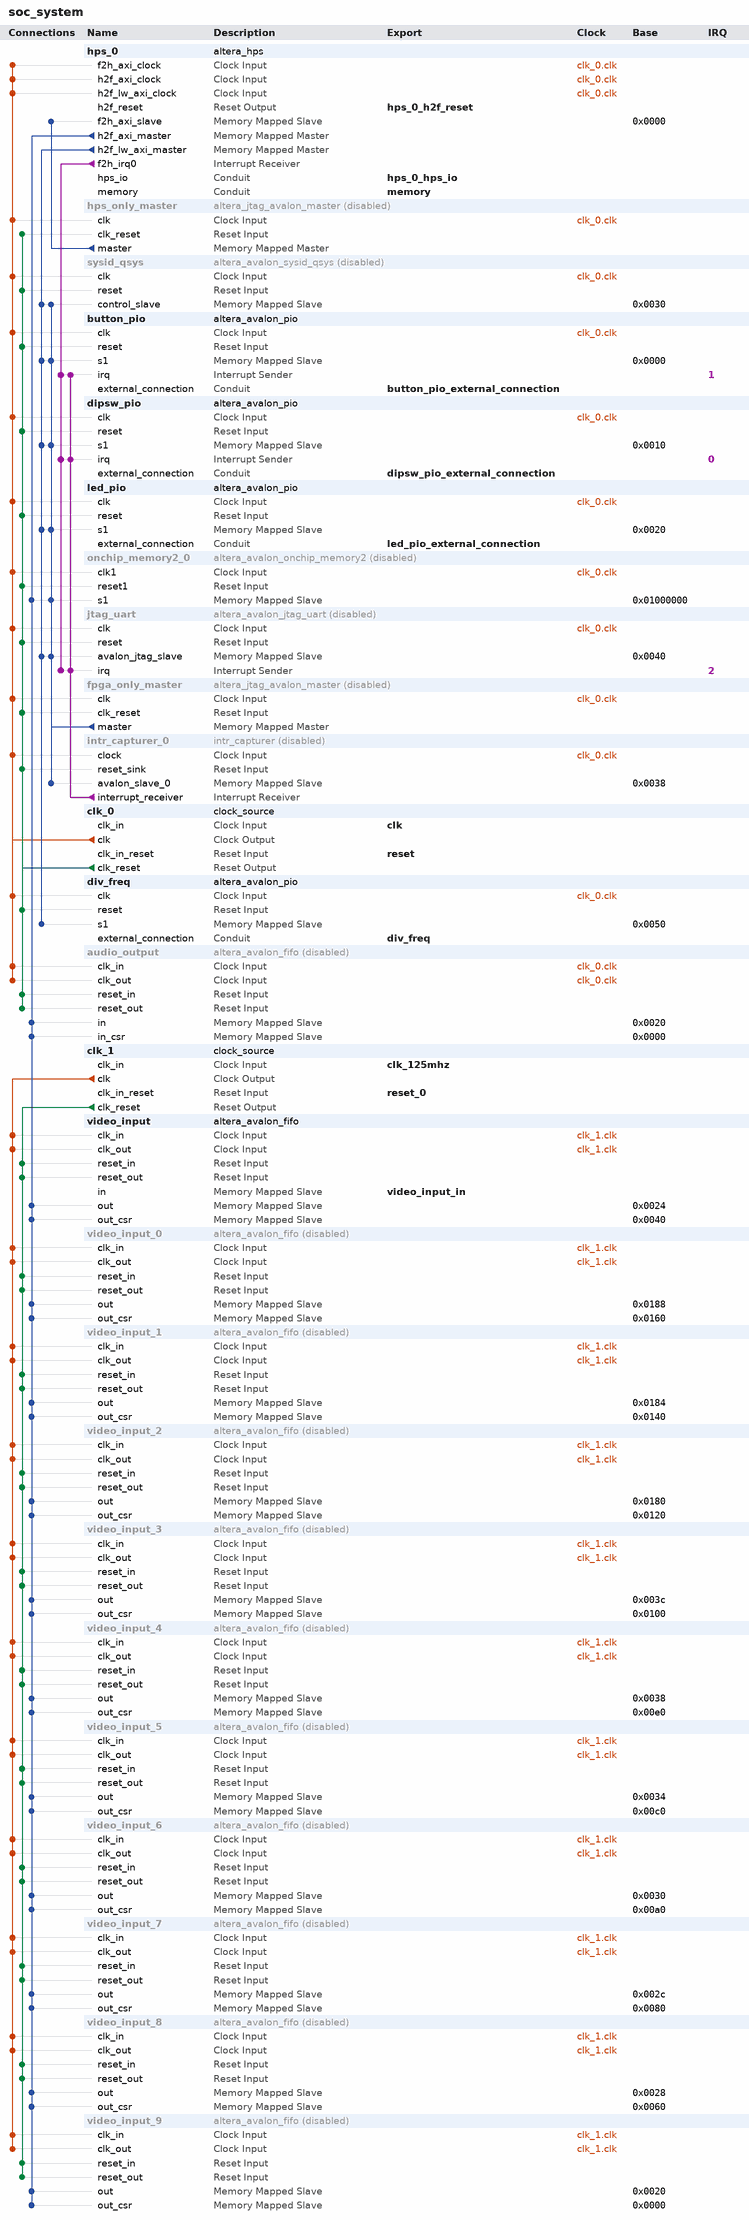
[diagram p0: system contents]
# Platform Designer (Qsys) system soc_system, Cyclone V 5CSEMA4U23C6
# Parameters at their usual value, and those the tool derives, are not listed.
package require -exact qsys 15.0
create_system soc_system
set_project_property DEVICE_FAMILY {Cyclone V}
set_project_property DEVICE 5CSEMA4U23C6

add_instance hps_0 altera_hps 15.0
set_instance_parameter_value hps_0 EMAC1_Mode RGMII
set_instance_parameter_value hps_0 EMAC1_PinMuxing {HPS I/O Set 0}
set_instance_parameter_value hps_0 F2SCLK_COLDRST_Enable false
set_instance_parameter_value hps_0 F2SCLK_DBGRST_Enable false
set_instance_parameter_value hps_0 F2SCLK_WARMRST_Enable false
set_instance_parameter_value hps_0 F2SINTERRUPT_Enable true
set_instance_parameter_value hps_0 F2S_Width 3
set_instance_parameter_value hps_0 FPGA_PERIPHERAL_OUTPUT_CLOCK_FREQ_EMAC0_GTX_CLK 100
set_instance_parameter_value hps_0 FPGA_PERIPHERAL_OUTPUT_CLOCK_FREQ_EMAC0_MD_CLK 100.0
set_instance_parameter_value hps_0 FPGA_PERIPHERAL_OUTPUT_CLOCK_FREQ_EMAC1_GTX_CLK 100
set_instance_parameter_value hps_0 FPGA_PERIPHERAL_OUTPUT_CLOCK_FREQ_EMAC1_MD_CLK 100.0
set_instance_parameter_value hps_0 HPS_PROTOCOL DDR3
set_instance_parameter_value hps_0 I2C0_Mode I2C
set_instance_parameter_value hps_0 I2C0_PinMuxing {HPS I/O Set 0}
set_instance_parameter_value hps_0 I2C1_Mode I2C
set_instance_parameter_value hps_0 I2C1_PinMuxing {HPS I/O Set 0}
set_instance_parameter_value hps_0 LWH2F_Enable true
set_instance_parameter_value hps_0 MEM_BANKADDR_WIDTH 3
set_instance_parameter_value hps_0 MEM_CLK_FREQ 400.0
set_instance_parameter_value hps_0 MEM_COL_ADDR_WIDTH 10
set_instance_parameter_value hps_0 MEM_DQ_WIDTH 32
set_instance_parameter_value hps_0 MEM_DRV_STR RZQ/6
set_instance_parameter_value hps_0 MEM_ROW_ADDR_WIDTH 15
set_instance_parameter_value hps_0 MEM_RTT_NOM RZQ/6
set_instance_parameter_value hps_0 MEM_RTT_WR {Dynamic ODT off}
set_instance_parameter_value hps_0 MEM_TCL 7
set_instance_parameter_value hps_0 MEM_TFAW_NS 37.5
set_instance_parameter_value hps_0 MEM_TRAS_NS 35.0
set_instance_parameter_value hps_0 MEM_TRCD_NS 13.75
set_instance_parameter_value hps_0 MEM_TRFC_NS 300.0
set_instance_parameter_value hps_0 MEM_TRP_NS 13.75
set_instance_parameter_value hps_0 MEM_VENDOR Other
set_instance_parameter_value hps_0 MEM_WTCL 7
set_instance_parameter_value hps_0 QSPI_Mode N/A
set_instance_parameter_value hps_0 QSPI_PinMuxing Unused
set_instance_parameter_value hps_0 REF_CLK_FREQ 25.0
set_instance_parameter_value hps_0 S2F_Width 2
set_instance_parameter_value hps_0 SDIO_Mode {4-bit Data}
set_instance_parameter_value hps_0 SDIO_PinMuxing {HPS I/O Set 0}
set_instance_parameter_value hps_0 SPIM1_Mode {Single Slave Select}
set_instance_parameter_value hps_0 SPIM1_PinMuxing {HPS I/O Set 0}
set_instance_parameter_value hps_0 STM_Enable false
set_instance_parameter_value hps_0 TIMING_BOARD_AC_SKEW 0.02
set_instance_parameter_value hps_0 TIMING_BOARD_AC_TO_CK_SKEW 0.0
set_instance_parameter_value hps_0 TIMING_BOARD_DQ_TO_DQS_SKEW 0.0
set_instance_parameter_value hps_0 TIMING_BOARD_MAX_CK_DELAY 0.6
set_instance_parameter_value hps_0 TIMING_BOARD_MAX_DQS_DELAY 0.6
set_instance_parameter_value hps_0 TIMING_BOARD_SKEW_BETWEEN_DQS 0.02
set_instance_parameter_value hps_0 TIMING_BOARD_SKEW_CKDQS_DIMM_MAX 0.01
set_instance_parameter_value hps_0 TIMING_BOARD_SKEW_CKDQS_DIMM_MIN -0.01
set_instance_parameter_value hps_0 TIMING_BOARD_SKEW_WITHIN_DQS 0.02
set_instance_parameter_value hps_0 TIMING_TDH 125
set_instance_parameter_value hps_0 TIMING_TDQSCK 400
set_instance_parameter_value hps_0 TIMING_TDQSQ 120
set_instance_parameter_value hps_0 TIMING_TDS 50
set_instance_parameter_value hps_0 TIMING_TIH 250
set_instance_parameter_value hps_0 TIMING_TIS 175
set_instance_parameter_value hps_0 TIMING_TQSH 0.38
set_instance_parameter_value hps_0 UART0_Mode {No Flow Control}
set_instance_parameter_value hps_0 UART0_PinMuxing {HPS I/O Set 0}
set_instance_parameter_value hps_0 USB1_Mode SDR
set_instance_parameter_value hps_0 USB1_PinMuxing {HPS I/O Set 0}
set_instance_parameter_value hps_0 desired_cfg_clk_mhz 100.0
set_instance_parameter_value hps_0 desired_qspi_clk_mhz 370.0

add_instance hps_only_master altera_jtag_avalon_master 15.0
set_instance_property hps_only_master ENABLED false

add_instance sysid_qsys altera_avalon_sysid_qsys 15.0
set_instance_property sysid_qsys ENABLED false
set_instance_parameter_value sysid_qsys id -1395322110

add_instance button_pio altera_avalon_pio 15.0
set_instance_parameter_value button_pio bitClearingEdgeCapReg true
set_instance_parameter_value button_pio captureEdge true
set_instance_parameter_value button_pio direction Input
set_instance_parameter_value button_pio edgeType FALLING
set_instance_parameter_value button_pio generateIRQ true
set_instance_parameter_value button_pio irqType EDGE
set_instance_parameter_value button_pio width 4

add_instance dipsw_pio altera_avalon_pio 15.0
set_instance_parameter_value dipsw_pio bitClearingEdgeCapReg true
set_instance_parameter_value dipsw_pio captureEdge true
set_instance_parameter_value dipsw_pio direction Input
set_instance_parameter_value dipsw_pio edgeType ANY
set_instance_parameter_value dipsw_pio generateIRQ true
set_instance_parameter_value dipsw_pio irqType EDGE
set_instance_parameter_value dipsw_pio width 4

add_instance led_pio altera_avalon_pio 15.0
set_instance_parameter_value led_pio direction Output
set_instance_parameter_value led_pio width 8

add_instance onchip_memory2_0 altera_avalon_onchip_memory2 15.0
set_instance_property onchip_memory2_0 ENABLED false
set_instance_parameter_value onchip_memory2_0 dataWidth 64
set_instance_parameter_value onchip_memory2_0 dualPort false
set_instance_parameter_value onchip_memory2_0 initMemContent true
set_instance_parameter_value onchip_memory2_0 initializationFileName onchip_memory2_0
set_instance_parameter_value onchip_memory2_0 memorySize 65536

add_instance jtag_uart altera_avalon_jtag_uart 15.0
set_instance_property jtag_uart ENABLED false
set_instance_parameter_value jtag_uart allowMultipleConnections true
set_instance_parameter_value jtag_uart simInteractiveOptions INTERACTIVE_ASCII_OUTPUT

add_instance fpga_only_master altera_jtag_avalon_master 15.0
set_instance_property fpga_only_master ENABLED false

add_instance intr_capturer_0 intr_capturer 100.99.98.97
set_instance_property intr_capturer_0 ENABLED false

add_instance clk_0 clock_source 15.0
set_instance_parameter_value clk_0 clockFrequency 50000000

add_instance div_freq altera_avalon_pio 15.0
set_instance_parameter_value div_freq direction Output
set_instance_parameter_value div_freq width 32

add_instance audio_output altera_avalon_fifo 15.0
set_instance_property audio_output ENABLED false
set_instance_parameter_value audio_output bitsPerSymbol 16
set_instance_parameter_value audio_output channelWidth 8
set_instance_parameter_value audio_output errorWidth 8
set_instance_parameter_value audio_output fifoDepth 256
set_instance_parameter_value audio_output fifoInputInterfaceOptions AVALONMM_WRITE
set_instance_parameter_value audio_output fifoOutputInterfaceOptions AVALONMM_READ
set_instance_parameter_value audio_output singleClockMode false
set_instance_parameter_value audio_output symbolsPerBeat 2
set_instance_parameter_value audio_output useIRQ false
set_instance_parameter_value audio_output usePacket true
set_instance_parameter_value audio_output useReadControl false

add_instance clk_1 clock_source 15.0
set_instance_parameter_value clk_1 clockFrequency 125000000

add_instance video_input altera_avalon_fifo 15.0
set_instance_parameter_value video_input bitsPerSymbol 16
set_instance_parameter_value video_input channelWidth 8
set_instance_parameter_value video_input errorWidth 8
set_instance_parameter_value video_input fifoDepth 1024
set_instance_parameter_value video_input fifoInputInterfaceOptions AVALONMM_WRITE
set_instance_parameter_value video_input fifoOutputInterfaceOptions AVALONMM_READ
set_instance_parameter_value video_input singleClockMode false
set_instance_parameter_value video_input symbolsPerBeat 2
set_instance_parameter_value video_input useIRQ false
set_instance_parameter_value video_input usePacket true
set_instance_parameter_value video_input useReadControl true
set_instance_parameter_value video_input useWriteControl false

add_instance video_input_0 altera_avalon_fifo 15.0
set_instance_property video_input_0 ENABLED false
set_instance_parameter_value video_input_0 bitsPerSymbol 16
set_instance_parameter_value video_input_0 channelWidth 8
set_instance_parameter_value video_input_0 errorWidth 8
set_instance_parameter_value video_input_0 fifoDepth 1024
set_instance_parameter_value video_input_0 fifoInputInterfaceOptions AVALONMM_WRITE
set_instance_parameter_value video_input_0 fifoOutputInterfaceOptions AVALONMM_READ
set_instance_parameter_value video_input_0 singleClockMode false
set_instance_parameter_value video_input_0 symbolsPerBeat 2
set_instance_parameter_value video_input_0 useIRQ false
set_instance_parameter_value video_input_0 usePacket true
set_instance_parameter_value video_input_0 useReadControl true
set_instance_parameter_value video_input_0 useWriteControl false

add_instance video_input_1 altera_avalon_fifo 15.0
set_instance_property video_input_1 ENABLED false
set_instance_parameter_value video_input_1 bitsPerSymbol 16
set_instance_parameter_value video_input_1 channelWidth 8
set_instance_parameter_value video_input_1 errorWidth 8
set_instance_parameter_value video_input_1 fifoDepth 1024
set_instance_parameter_value video_input_1 fifoInputInterfaceOptions AVALONMM_WRITE
set_instance_parameter_value video_input_1 fifoOutputInterfaceOptions AVALONMM_READ
set_instance_parameter_value video_input_1 singleClockMode false
set_instance_parameter_value video_input_1 symbolsPerBeat 2
set_instance_parameter_value video_input_1 useIRQ false
set_instance_parameter_value video_input_1 usePacket true
set_instance_parameter_value video_input_1 useReadControl true
set_instance_parameter_value video_input_1 useWriteControl false

add_instance video_input_2 altera_avalon_fifo 15.0
set_instance_property video_input_2 ENABLED false
set_instance_parameter_value video_input_2 bitsPerSymbol 16
set_instance_parameter_value video_input_2 channelWidth 8
set_instance_parameter_value video_input_2 errorWidth 8
set_instance_parameter_value video_input_2 fifoDepth 1024
set_instance_parameter_value video_input_2 fifoInputInterfaceOptions AVALONMM_WRITE
set_instance_parameter_value video_input_2 fifoOutputInterfaceOptions AVALONMM_READ
set_instance_parameter_value video_input_2 singleClockMode false
set_instance_parameter_value video_input_2 symbolsPerBeat 2
set_instance_parameter_value video_input_2 useIRQ false
set_instance_parameter_value video_input_2 usePacket true
set_instance_parameter_value video_input_2 useReadControl true
set_instance_parameter_value video_input_2 useWriteControl false

add_instance video_input_3 altera_avalon_fifo 15.0
set_instance_property video_input_3 ENABLED false
set_instance_parameter_value video_input_3 bitsPerSymbol 16
set_instance_parameter_value video_input_3 channelWidth 8
set_instance_parameter_value video_input_3 errorWidth 8
set_instance_parameter_value video_input_3 fifoDepth 1024
set_instance_parameter_value video_input_3 fifoInputInterfaceOptions AVALONMM_WRITE
set_instance_parameter_value video_input_3 fifoOutputInterfaceOptions AVALONMM_READ
set_instance_parameter_value video_input_3 singleClockMode false
set_instance_parameter_value video_input_3 symbolsPerBeat 2
set_instance_parameter_value video_input_3 useIRQ false
set_instance_parameter_value video_input_3 usePacket true
set_instance_parameter_value video_input_3 useReadControl true
set_instance_parameter_value video_input_3 useWriteControl false

add_instance video_input_4 altera_avalon_fifo 15.0
set_instance_property video_input_4 ENABLED false
set_instance_parameter_value video_input_4 bitsPerSymbol 16
set_instance_parameter_value video_input_4 channelWidth 8
set_instance_parameter_value video_input_4 errorWidth 8
set_instance_parameter_value video_input_4 fifoDepth 1024
set_instance_parameter_value video_input_4 fifoInputInterfaceOptions AVALONMM_WRITE
set_instance_parameter_value video_input_4 fifoOutputInterfaceOptions AVALONMM_READ
set_instance_parameter_value video_input_4 singleClockMode false
set_instance_parameter_value video_input_4 symbolsPerBeat 2
set_instance_parameter_value video_input_4 useIRQ false
set_instance_parameter_value video_input_4 usePacket true
set_instance_parameter_value video_input_4 useReadControl true
set_instance_parameter_value video_input_4 useWriteControl false

add_instance video_input_5 altera_avalon_fifo 15.0
set_instance_property video_input_5 ENABLED false
set_instance_parameter_value video_input_5 bitsPerSymbol 16
set_instance_parameter_value video_input_5 channelWidth 8
set_instance_parameter_value video_input_5 errorWidth 8
set_instance_parameter_value video_input_5 fifoDepth 1024
set_instance_parameter_value video_input_5 fifoInputInterfaceOptions AVALONMM_WRITE
set_instance_parameter_value video_input_5 fifoOutputInterfaceOptions AVALONMM_READ
set_instance_parameter_value video_input_5 singleClockMode false
set_instance_parameter_value video_input_5 symbolsPerBeat 2
set_instance_parameter_value video_input_5 useIRQ false
set_instance_parameter_value video_input_5 usePacket true
set_instance_parameter_value video_input_5 useReadControl true
set_instance_parameter_value video_input_5 useWriteControl false

add_instance video_input_6 altera_avalon_fifo 15.0
set_instance_property video_input_6 ENABLED false
set_instance_parameter_value video_input_6 bitsPerSymbol 16
set_instance_parameter_value video_input_6 channelWidth 8
set_instance_parameter_value video_input_6 errorWidth 8
set_instance_parameter_value video_input_6 fifoDepth 1024
set_instance_parameter_value video_input_6 fifoInputInterfaceOptions AVALONMM_WRITE
set_instance_parameter_value video_input_6 fifoOutputInterfaceOptions AVALONMM_READ
set_instance_parameter_value video_input_6 singleClockMode false
set_instance_parameter_value video_input_6 symbolsPerBeat 2
set_instance_parameter_value video_input_6 useIRQ false
set_instance_parameter_value video_input_6 usePacket true
set_instance_parameter_value video_input_6 useReadControl true
set_instance_parameter_value video_input_6 useWriteControl false

add_instance video_input_7 altera_avalon_fifo 15.0
set_instance_property video_input_7 ENABLED false
set_instance_parameter_value video_input_7 bitsPerSymbol 16
set_instance_parameter_value video_input_7 channelWidth 8
set_instance_parameter_value video_input_7 errorWidth 8
set_instance_parameter_value video_input_7 fifoDepth 1024
set_instance_parameter_value video_input_7 fifoInputInterfaceOptions AVALONMM_WRITE
set_instance_parameter_value video_input_7 fifoOutputInterfaceOptions AVALONMM_READ
set_instance_parameter_value video_input_7 singleClockMode false
set_instance_parameter_value video_input_7 symbolsPerBeat 2
set_instance_parameter_value video_input_7 useIRQ false
set_instance_parameter_value video_input_7 usePacket true
set_instance_parameter_value video_input_7 useReadControl true
set_instance_parameter_value video_input_7 useWriteControl false

add_instance video_input_8 altera_avalon_fifo 15.0
set_instance_property video_input_8 ENABLED false
set_instance_parameter_value video_input_8 bitsPerSymbol 16
set_instance_parameter_value video_input_8 channelWidth 8
set_instance_parameter_value video_input_8 errorWidth 8
set_instance_parameter_value video_input_8 fifoDepth 1024
set_instance_parameter_value video_input_8 fifoInputInterfaceOptions AVALONMM_WRITE
set_instance_parameter_value video_input_8 fifoOutputInterfaceOptions AVALONMM_READ
set_instance_parameter_value video_input_8 singleClockMode false
set_instance_parameter_value video_input_8 symbolsPerBeat 2
set_instance_parameter_value video_input_8 useIRQ false
set_instance_parameter_value video_input_8 usePacket true
set_instance_parameter_value video_input_8 useReadControl true
set_instance_parameter_value video_input_8 useWriteControl false

add_instance video_input_9 altera_avalon_fifo 15.0
set_instance_property video_input_9 ENABLED false
set_instance_parameter_value video_input_9 bitsPerSymbol 16
set_instance_parameter_value video_input_9 channelWidth 8
set_instance_parameter_value video_input_9 errorWidth 8
set_instance_parameter_value video_input_9 fifoDepth 1024
set_instance_parameter_value video_input_9 fifoInputInterfaceOptions AVALONMM_WRITE
set_instance_parameter_value video_input_9 fifoOutputInterfaceOptions AVALONMM_READ
set_instance_parameter_value video_input_9 singleClockMode false
set_instance_parameter_value video_input_9 symbolsPerBeat 2
set_instance_parameter_value video_input_9 useIRQ false
set_instance_parameter_value video_input_9 usePacket true
set_instance_parameter_value video_input_9 useReadControl true
set_instance_parameter_value video_input_9 useWriteControl false

# connections
add_connection clk_0.clk audio_output.clk_in clock
add_connection clk_0.clk audio_output.clk_out clock
add_connection clk_0.clk button_pio.clk clock
add_connection clk_0.clk dipsw_pio.clk clock
add_connection clk_0.clk div_freq.clk clock
add_connection clk_0.clk fpga_only_master.clk clock
add_connection clk_0.clk hps_0.f2h_axi_clock clock
add_connection clk_0.clk hps_0.h2f_axi_clock clock
add_connection clk_0.clk hps_0.h2f_lw_axi_clock clock
add_connection clk_0.clk hps_only_master.clk clock
add_connection clk_0.clk intr_capturer_0.clock clock
add_connection clk_0.clk jtag_uart.clk clock
add_connection clk_0.clk led_pio.clk clock
add_connection clk_0.clk onchip_memory2_0.clk1 clock
add_connection clk_0.clk sysid_qsys.clk clock
add_connection clk_1.clk video_input.clk_in clock
add_connection clk_1.clk video_input.clk_out clock
add_connection clk_1.clk video_input_0.clk_in clock
add_connection clk_1.clk video_input_0.clk_out clock
add_connection clk_1.clk video_input_1.clk_in clock
add_connection clk_1.clk video_input_1.clk_out clock
add_connection clk_1.clk video_input_2.clk_in clock
add_connection clk_1.clk video_input_2.clk_out clock
add_connection clk_1.clk video_input_3.clk_in clock
add_connection clk_1.clk video_input_3.clk_out clock
add_connection clk_1.clk video_input_4.clk_in clock
add_connection clk_1.clk video_input_4.clk_out clock
add_connection clk_1.clk video_input_5.clk_in clock
add_connection clk_1.clk video_input_5.clk_out clock
add_connection clk_1.clk video_input_6.clk_in clock
add_connection clk_1.clk video_input_6.clk_out clock
add_connection clk_1.clk video_input_7.clk_in clock
add_connection clk_1.clk video_input_7.clk_out clock
add_connection clk_1.clk video_input_8.clk_in clock
add_connection clk_1.clk video_input_8.clk_out clock
add_connection clk_1.clk video_input_9.clk_in clock
add_connection clk_1.clk video_input_9.clk_out clock
add_connection clk_0.clk_reset audio_output.reset_in reset
add_connection clk_0.clk_reset audio_output.reset_out reset
add_connection clk_0.clk_reset button_pio.reset reset
add_connection clk_0.clk_reset dipsw_pio.reset reset
add_connection clk_0.clk_reset div_freq.reset reset
add_connection clk_0.clk_reset fpga_only_master.clk_reset reset
add_connection clk_0.clk_reset hps_only_master.clk_reset reset
add_connection clk_0.clk_reset intr_capturer_0.reset_sink reset
add_connection clk_0.clk_reset jtag_uart.reset reset
add_connection clk_0.clk_reset led_pio.reset reset
add_connection clk_0.clk_reset onchip_memory2_0.reset1 reset
add_connection clk_0.clk_reset sysid_qsys.reset reset
add_connection clk_1.clk_reset video_input.reset_in reset
add_connection clk_1.clk_reset video_input.reset_out reset
add_connection clk_1.clk_reset video_input_0.reset_in reset
add_connection clk_1.clk_reset video_input_0.reset_out reset
add_connection clk_1.clk_reset video_input_1.reset_in reset
add_connection clk_1.clk_reset video_input_1.reset_out reset
add_connection clk_1.clk_reset video_input_2.reset_in reset
add_connection clk_1.clk_reset video_input_2.reset_out reset
add_connection clk_1.clk_reset video_input_3.reset_in reset
add_connection clk_1.clk_reset video_input_3.reset_out reset
add_connection clk_1.clk_reset video_input_4.reset_in reset
add_connection clk_1.clk_reset video_input_4.reset_out reset
add_connection clk_1.clk_reset video_input_5.reset_in reset
add_connection clk_1.clk_reset video_input_5.reset_out reset
add_connection clk_1.clk_reset video_input_6.reset_in reset
add_connection clk_1.clk_reset video_input_6.reset_out reset
add_connection clk_1.clk_reset video_input_7.reset_in reset
add_connection clk_1.clk_reset video_input_7.reset_out reset
add_connection clk_1.clk_reset video_input_8.reset_in reset
add_connection clk_1.clk_reset video_input_8.reset_out reset
add_connection clk_1.clk_reset video_input_9.reset_in reset
add_connection clk_1.clk_reset video_input_9.reset_out reset
add_connection fpga_only_master.master button_pio.s1 avalon
set_connection_parameter_value fpga_only_master.master/button_pio.s1 baseAddress 0x0000
add_connection fpga_only_master.master dipsw_pio.s1 avalon
set_connection_parameter_value fpga_only_master.master/dipsw_pio.s1 baseAddress 0x0010
add_connection fpga_only_master.master intr_capturer_0.avalon_slave_0 avalon
set_connection_parameter_value fpga_only_master.master/intr_capturer_0.avalon_slave_0 baseAddress 0x0038
add_connection fpga_only_master.master jtag_uart.avalon_jtag_slave avalon
set_connection_parameter_value fpga_only_master.master/jtag_uart.avalon_jtag_slave baseAddress 0x0040
add_connection fpga_only_master.master led_pio.s1 avalon
set_connection_parameter_value fpga_only_master.master/led_pio.s1 baseAddress 0x0020
add_connection fpga_only_master.master onchip_memory2_0.s1 avalon
set_connection_parameter_value fpga_only_master.master/onchip_memory2_0.s1 baseAddress 0x01000000
add_connection fpga_only_master.master sysid_qsys.control_slave avalon
set_connection_parameter_value fpga_only_master.master/sysid_qsys.control_slave baseAddress 0x0030
add_connection hps_0.h2f_axi_master audio_output.in avalon
set_connection_parameter_value hps_0.h2f_axi_master/audio_output.in baseAddress 0x0020
add_connection hps_0.h2f_axi_master audio_output.in_csr avalon
set_connection_parameter_value hps_0.h2f_axi_master/audio_output.in_csr baseAddress 0x0000
add_connection hps_0.h2f_axi_master onchip_memory2_0.s1 avalon
set_connection_parameter_value hps_0.h2f_axi_master/onchip_memory2_0.s1 baseAddress 0x01000000
add_connection hps_0.h2f_axi_master video_input.out avalon
set_connection_parameter_value hps_0.h2f_axi_master/video_input.out baseAddress 0x0024
add_connection hps_0.h2f_axi_master video_input.out_csr avalon
set_connection_parameter_value hps_0.h2f_axi_master/video_input.out_csr baseAddress 0x0040
add_connection hps_0.h2f_axi_master video_input_0.out avalon
set_connection_parameter_value hps_0.h2f_axi_master/video_input_0.out baseAddress 0x0188
add_connection hps_0.h2f_axi_master video_input_0.out_csr avalon
set_connection_parameter_value hps_0.h2f_axi_master/video_input_0.out_csr baseAddress 0x0160
add_connection hps_0.h2f_axi_master video_input_1.out avalon
set_connection_parameter_value hps_0.h2f_axi_master/video_input_1.out baseAddress 0x0184
add_connection hps_0.h2f_axi_master video_input_1.out_csr avalon
set_connection_parameter_value hps_0.h2f_axi_master/video_input_1.out_csr baseAddress 0x0140
add_connection hps_0.h2f_axi_master video_input_2.out avalon
set_connection_parameter_value hps_0.h2f_axi_master/video_input_2.out baseAddress 0x0180
add_connection hps_0.h2f_axi_master video_input_2.out_csr avalon
set_connection_parameter_value hps_0.h2f_axi_master/video_input_2.out_csr baseAddress 0x0120
add_connection hps_0.h2f_axi_master video_input_3.out avalon
set_connection_parameter_value hps_0.h2f_axi_master/video_input_3.out baseAddress 0x003c
add_connection hps_0.h2f_axi_master video_input_3.out_csr avalon
set_connection_parameter_value hps_0.h2f_axi_master/video_input_3.out_csr baseAddress 0x0100
add_connection hps_0.h2f_axi_master video_input_4.out avalon
set_connection_parameter_value hps_0.h2f_axi_master/video_input_4.out baseAddress 0x0038
add_connection hps_0.h2f_axi_master video_input_4.out_csr avalon
set_connection_parameter_value hps_0.h2f_axi_master/video_input_4.out_csr baseAddress 0x00e0
add_connection hps_0.h2f_axi_master video_input_5.out avalon
set_connection_parameter_value hps_0.h2f_axi_master/video_input_5.out baseAddress 0x0034
add_connection hps_0.h2f_axi_master video_input_5.out_csr avalon
set_connection_parameter_value hps_0.h2f_axi_master/video_input_5.out_csr baseAddress 0x00c0
add_connection hps_0.h2f_axi_master video_input_6.out avalon
set_connection_parameter_value hps_0.h2f_axi_master/video_input_6.out baseAddress 0x0030
add_connection hps_0.h2f_axi_master video_input_6.out_csr avalon
set_connection_parameter_value hps_0.h2f_axi_master/video_input_6.out_csr baseAddress 0x00a0
add_connection hps_0.h2f_axi_master video_input_7.out avalon
set_connection_parameter_value hps_0.h2f_axi_master/video_input_7.out baseAddress 0x002c
add_connection hps_0.h2f_axi_master video_input_7.out_csr avalon
set_connection_parameter_value hps_0.h2f_axi_master/video_input_7.out_csr baseAddress 0x0080
add_connection hps_0.h2f_axi_master video_input_8.out avalon
set_connection_parameter_value hps_0.h2f_axi_master/video_input_8.out baseAddress 0x0028
add_connection hps_0.h2f_axi_master video_input_8.out_csr avalon
set_connection_parameter_value hps_0.h2f_axi_master/video_input_8.out_csr baseAddress 0x0060
add_connection hps_0.h2f_axi_master video_input_9.out avalon
set_connection_parameter_value hps_0.h2f_axi_master/video_input_9.out baseAddress 0x0020
add_connection hps_0.h2f_axi_master video_input_9.out_csr avalon
set_connection_parameter_value hps_0.h2f_axi_master/video_input_9.out_csr baseAddress 0x0000
add_connection hps_0.h2f_lw_axi_master button_pio.s1 avalon
set_connection_parameter_value hps_0.h2f_lw_axi_master/button_pio.s1 baseAddress 0x0000
add_connection hps_0.h2f_lw_axi_master dipsw_pio.s1 avalon
set_connection_parameter_value hps_0.h2f_lw_axi_master/dipsw_pio.s1 baseAddress 0x0010
add_connection hps_0.h2f_lw_axi_master div_freq.s1 avalon
set_connection_parameter_value hps_0.h2f_lw_axi_master/div_freq.s1 baseAddress 0x0050
add_connection hps_0.h2f_lw_axi_master jtag_uart.avalon_jtag_slave avalon
set_connection_parameter_value hps_0.h2f_lw_axi_master/jtag_uart.avalon_jtag_slave baseAddress 0x0040
add_connection hps_0.h2f_lw_axi_master led_pio.s1 avalon
set_connection_parameter_value hps_0.h2f_lw_axi_master/led_pio.s1 baseAddress 0x0020
add_connection hps_0.h2f_lw_axi_master sysid_qsys.control_slave avalon
set_connection_parameter_value hps_0.h2f_lw_axi_master/sysid_qsys.control_slave baseAddress 0x0030
add_connection hps_only_master.master hps_0.f2h_axi_slave avalon
set_connection_parameter_value hps_only_master.master/hps_0.f2h_axi_slave baseAddress 0x0000
add_connection hps_0.f2h_irq0 button_pio.irq interrupt
set_connection_parameter_value hps_0.f2h_irq0/button_pio.irq irqNumber 1
add_connection hps_0.f2h_irq0 dipsw_pio.irq interrupt
set_connection_parameter_value hps_0.f2h_irq0/dipsw_pio.irq irqNumber 0
add_connection hps_0.f2h_irq0 jtag_uart.irq interrupt
set_connection_parameter_value hps_0.f2h_irq0/jtag_uart.irq irqNumber 2
add_connection intr_capturer_0.interrupt_receiver button_pio.irq interrupt
set_connection_parameter_value intr_capturer_0.interrupt_receiver/button_pio.irq irqNumber 1
add_connection intr_capturer_0.interrupt_receiver dipsw_pio.irq interrupt
set_connection_parameter_value intr_capturer_0.interrupt_receiver/dipsw_pio.irq irqNumber 0
add_connection intr_capturer_0.interrupt_receiver jtag_uart.irq interrupt
set_connection_parameter_value intr_capturer_0.interrupt_receiver/jtag_uart.irq irqNumber 2

# exported interfaces
add_interface button_pio_external_connection conduit end
set_interface_property button_pio_external_connection EXPORT_OF button_pio.external_connection
add_interface clk clock sink
set_interface_property clk EXPORT_OF clk_0.clk_in
add_interface clk_125mhz clock sink
set_interface_property clk_125mhz EXPORT_OF clk_1.clk_in
add_interface dipsw_pio_external_connection conduit end
set_interface_property dipsw_pio_external_connection EXPORT_OF dipsw_pio.external_connection
add_interface div_freq conduit end
set_interface_property div_freq EXPORT_OF div_freq.external_connection
add_interface hps_0_h2f_reset reset source
set_interface_property hps_0_h2f_reset EXPORT_OF hps_0.h2f_reset
add_interface hps_0_hps_io conduit end
set_interface_property hps_0_hps_io EXPORT_OF hps_0.hps_io
add_interface led_pio_external_connection conduit end
set_interface_property led_pio_external_connection EXPORT_OF led_pio.external_connection
add_interface memory conduit end
set_interface_property memory EXPORT_OF hps_0.memory
add_interface reset reset sink
set_interface_property reset EXPORT_OF clk_0.clk_in_reset
add_interface reset_0 reset sink
set_interface_property reset_0 EXPORT_OF clk_1.clk_in_reset
add_interface video_input_in avalon slave
set_interface_property video_input_in EXPORT_OF video_input.in

set_interconnect_requirement {$system} qsys_mm.clockCrossingAdapter HANDSHAKE
set_interconnect_requirement {$system} qsys_mm.maxAdditionalLatency 1

save_system soc_system.qsys
